# Altium schematic sheet ActiveMarkerDeck.SchDoc: Active Marker Deck
size A4; Author: Carl Friess; DrawnBy: Carl Friess; Revision: Rev 1
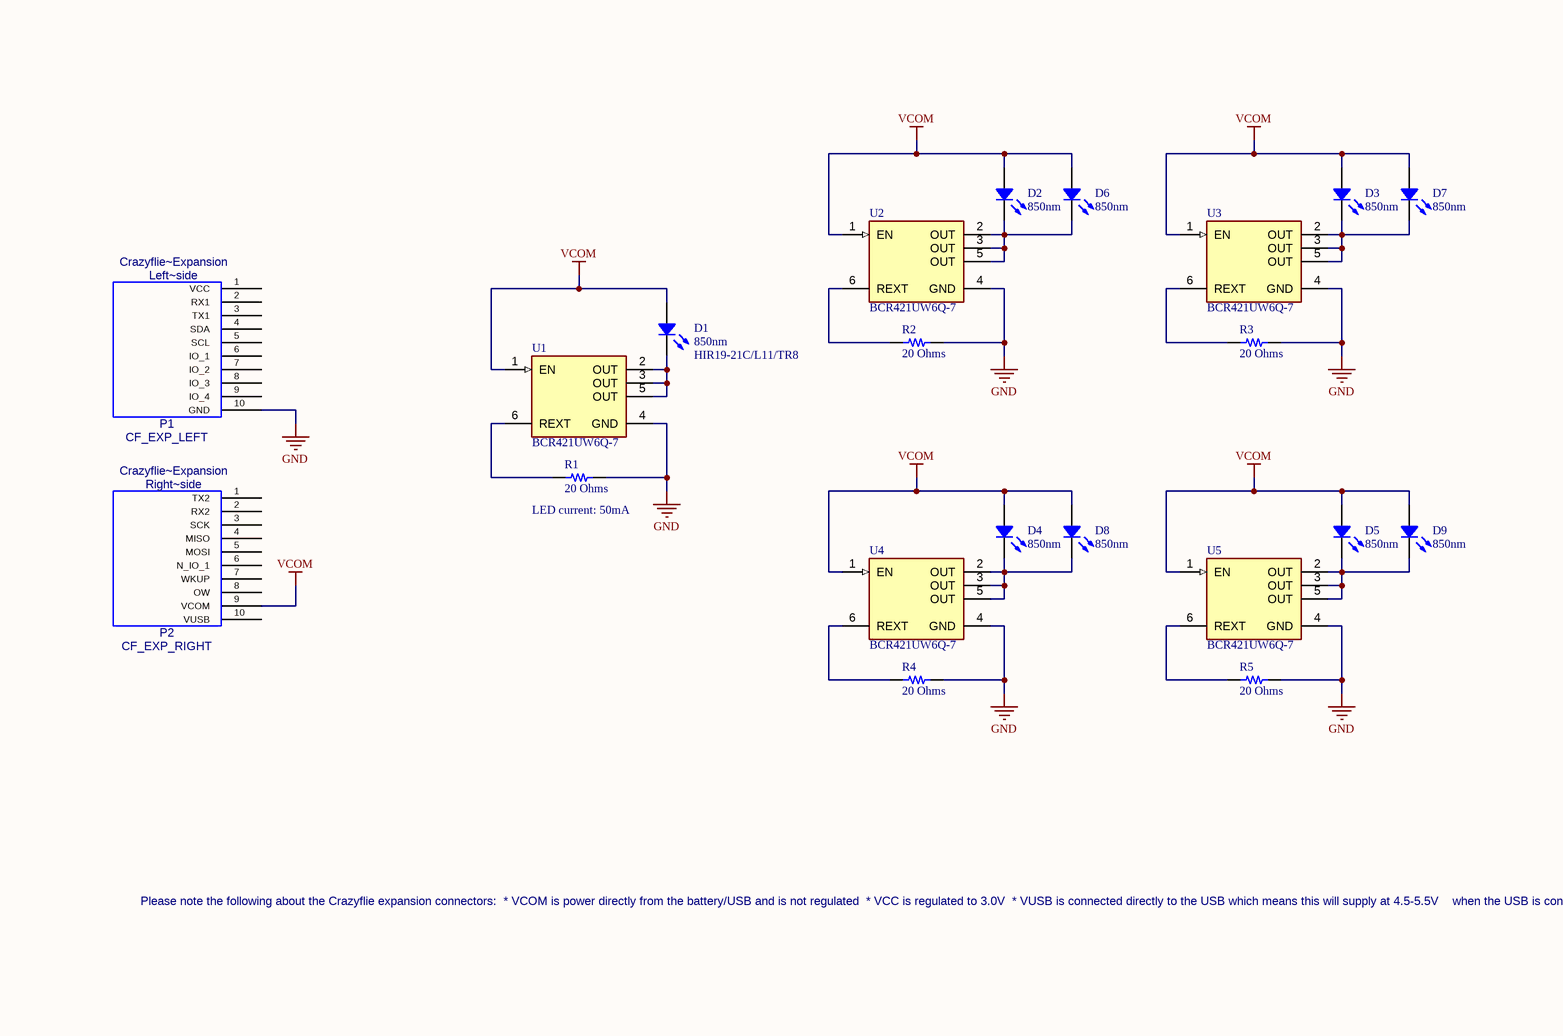
[diagram p0: ActiveMarkerDeck.SchDoc]

## Parts
D1  850nm  Supplier Part Number 1: HIR19-21C/L11/TR8  [LED 0603_1608 RED]
D2  850nm  [LED 0603_1608 RED]
D3  850nm  [LED 0603_1608 RED]
D4  850nm  [LED 0603_1608 RED]
D5  850nm  [LED 0603_1608 RED]
D6  850nm  [LED 0603_1608 RED]
D7  850nm  [LED 0603_1608 RED]
D8  850nm  [LED 0603_1608 RED]
D9  850nm  [LED 0603_1608 RED]
P1  CF_EXP_LEFT
P2  CF_EXP_RIGHT
R1  20 Ohms  [RES 0603_1608]
R2  20 Ohms  [RES 0603_1608]
R3  20 Ohms  [RES 0603_1608]
R4  20 Ohms  [RES 0603_1608]
R5  20 Ohms  [RES 0603_1608]
U1  BCR421UW6Q-7  [FP-SOT26_SC74R-MFG]
U2  BCR421UW6Q-7  [FP-SOT26_SC74R-MFG]
U3  BCR421UW6Q-7  [FP-SOT26_SC74R-MFG]
U4  BCR421UW6Q-7  [FP-SOT26_SC74R-MFG]
U5  BCR421UW6Q-7  [FP-SOT26_SC74R-MFG]

## Nets
GND: P1.10(GND) R1.2 R2.2 R3.2 R4.2 R5.2 U1.4(GND) U2.4(GND) U3.4(GND) U4.4(GND) U5.4(GND)
VCOM: D1.1 D2.1 D3.1 D4.1 D5.1 D6.1 D7.1 D8.1 D9.1 P2.9(VCOM) U1.1(EN) U2.1(EN) U3.1(EN) U4.1(EN) U5.1(EN)
NetD1_2: D1.2 U1.2(OUT) U1.3(OUT) U1.5(OUT)
NetD2_2: D2.2 D6.2 U2.2(OUT) U2.3(OUT) U2.5(OUT)
NetD3_2: D3.2 D7.2 U3.2(OUT) U3.3(OUT) U3.5(OUT)
NetD4_2: D4.2 D8.2 U4.2(OUT) U4.3(OUT) U4.5(OUT)
NetD5_2: D5.2 D9.2 U5.2(OUT) U5.3(OUT) U5.5(OUT)
NetR1_1: R1.1 U1.6(REXT)
NetR2_1: R2.1 U2.6(REXT)
NetR3_1: R3.1 U3.6(REXT)
NetR4_1: R4.1 U4.6(REXT)
NetR5_1: R5.1 U5.6(REXT)

Not connected (* = marked no-connect by the designer): P1 1(VCC) 2(RX1) 3(TX1) 4(SDA) 5(SCL) 6(IO_1) 7(IO_2) 8(IO_3) 9(IO_4); P2 1(TX2) 2(RX2) 3(SCK) 4(MISO) 5(MOSI) 6(N_IO_1) 7(WKUP) 8(OW) 10(VUSB)

## Notes on the sheet
- (near R1) LED current: 50mA
- Please note the following about the Crazyflie expansion connectors:
  * VCOM is power directly from the battery/USB and is not regulated
  * VCC is regulated to 3.0V
  * VUSB is connected directly to the USB which means this will supply at 4.5-5.5V
  when the USB is connected and can be used for charging the battery when the
  USB is not connected
- THIS DOCUMENT AND THE DATA DISCLOSED HEREIN OR
- HEREWITH IS THE PROPERTY OF ALTIUM LIMITED AND MAY
- DWG NO:
- REVISION
- REV:
- DESCRIPTION
- DATE
- APPROVED
- BE FREELY DISTRIBUTED IN WHOLE. NO RIGHTS ARE
- RESERVED OR EXPRESS OR IMPLIED WARANTEE GIVEN.
- ENG:
- APPROVALS
- PROJECT
- DSN:
- CHK:
- REFERENCE DOCUMENTS
- PROJECT REVISION:
- TITLE
- DOCUMENT REVISION:
- DESIGN ITEM:
- BOM:
- FAB DWG:
- PCB DWG:
- ASSY DWG:
- SCALE:
- A3
- SIZE
- CAGE CODE
- FILE NAME
- DWG NO.
- SHEET
- OF
- REV
- (in symbol CF_EXP_LEFT) Crazyflie~Expansion; Left~side
- (in symbol CF_EXP_RIGHT) Crazyflie~Expansion; Right~side

## Library data of the parts
D1-D9 = CL-196HR-CD-T: LED RED SMD; Manufacturer: Citizen; Configuration: Standard; Current - Test: 20mA; Lens Color: 0.60mm; Lens Size: 1.60mm x 0.80mm; Lens Style: Rectangle with Flat Top; Millicandela Rating: 23mcd; Voltage - Forward (Vf) (Typ): 1.8V; Wavelength - Dominant: 640nm; Part Number: CL-196HR-CD-T; Color: Red; ComponentLink1Description: Datasheet; ComponentLink1URL: http://ce.citizen.co.jp/up_img/product/zzOM8tpTLfGL/CL-196_e.pdf; ComponentLink2Description: DigiKey Link; ComponentLink2URL: https://www.digikey.com/en/products/detail/citizen/CL-196HR-CD-T/6005906; Device Package: 0603 (1608 Metric); Height (Max): 0.60mm; LastUpdated: 30/08/2022 14:34:25; Lifecycle Status: Active; Minimum Order: 1; Mounting Type: Surface Mount; Package / Case: 0603 (1608 Metric); Packaging: TapeAndReel; PartId: 499; Part Status: Active; Price: 0.06; Series: CL-196; Size / Dimension: 1.60mm L x 0.80mm W; Value: Red; Supplier 1: Arrow Electronics
  D2-D9: Supplier Part Number 1: HIR19-21C/L11/TR8
R1-R5 = RC0603JR-0720RL: RES 20 OHM 5% 1/10W 0603; Manufacturer: Yageo; Power (Watts): 0.1W, 1/10W; Temperature Coefficient: ±100ppm/°C; Part Number: RC0603JR-0720RL; Value: 20 Ohms; ComponentLink1Description: Datasheet; ComponentLink1URL: https://www.yageo.com/upload/media/product/productsearch/datasheet/rchip/PYu-RC_Group_51_RoHS_L_10.pdf; ComponentLink2Description: DigiKey Link; ComponentLink2URL: https://www.digikey.com/en/products/detail/yageo/RC0603JR-0720RL/726739; Composition: Thick Film; Device Package: 0603 (1608 Metric); Features: Moisture Resistant; Height - Seated (Max): 0.022" (0.55mm); LastUpdated: 01/09/2022 12:52:35; Lifecycle Status: Active; Minimum Order: 1; Number of Terminations: 2; Operating Temperature: -55°C ~ 155°C; Package / Case: 0603 (1608 Metric); Packaging: CutTape; PartId: 17211; Part Status: Active; Price: 0.01; Resistance: 20 Ohms; Series: RC_L; Size / Dimension: 0.063" L x 0.031" W (1.60mm x 0.80mm); Supplier 1: DigiKey; Supplier Part Number 1: 311-20GRCT-ND; Supplier Device Package: 0603; Tolerance: ±5%
U1-U5 = CMP-12753-000005-1: TRANSISTOR LED DRIVER SOT26 T&R; Manufacturer: Diodes Inc.; Output Current: 10mA; Number Of Outputs: 1; Max Junction Temp: +150°C; Automotive Grade: Grade 0; Description: 40V 350mA Adjustable LED Constant Current Regulator SOT-26-6; Standoff Height: 0.013mm; Dimming: PWM; Max Power Dissipation: 912mW; Output Voltage: 40V; Digikey Description: TRANSISTOR LED DRIVER SOT26 T&R; Octopart: https://octopart.com/bcr421uw6q-7-diodes+inc.-67219224; Lead Free: Yes; Package: SOT26 (SC74R); Footprint Url: https://www.diodes.com/assets/Package-Files/SOT26-SC74R.pdf; ComponentLink2URL: https://www.diodes.com/assets/Datasheets/BCR420UW6Q_BCR421UW6Q.pdf; ComponentLink2Description: Datasheet; Automotive: Yes; Temperature Range High: +150°C; Device Class L3: LED Drivers; RoHS: TRUE; Temperature Range Low: -55°C; Manufacturer Part Number: BCR421UW6Q-7; Device Class L2: Power Management ICs; Category: IC; Device Class L1: Integrated Circuits (ICs); Mouser Description: LED Lighting Drivers 40V Linear LED 1W 10mA 10% 350mA; Height: 1.4mm; Temperature: -55°C to +150°C
P1 = CF_EXP_LEFT: Value: CF_EXP_LEFT
P2 = CF_EXP_RIGHT: Value: CF_EXP_RIGHT